# EAGLE schematic mlx90640-shield (EAGLE 9.3.0)

## Sheet 1 of 2

## Sheet 2 of 2
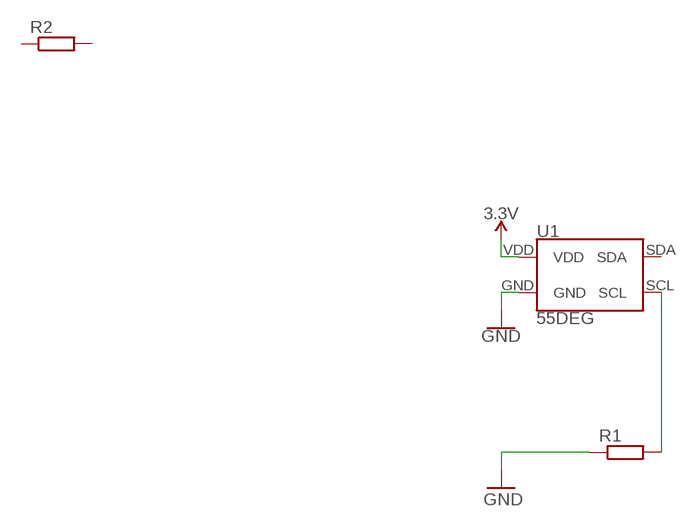
[diagram p0: schematic, sheet 2]

### Parts
R1  R-EU_0204/2V  [0204V]
R2  R-EU_0207/7  [0207/7]
U1  55DEG  MLX90540_MLX90640  [MLX90540_MLX90640]

### Nets
3.3V: U1.VDD
GND: R1.1 U1.GND
N$1: R1.2 U1.SCL
Unconnected: R2.1 R2.2 U1.SDA

## Library data of the parts
R1 R2 = rcl:R-EU_: RESISTOR, European symbol; SPICEPREFIX: R
U1 = SparkFun-IC-Special-Function:MLX90540_MLX90640: Melexis MLX90640 Infrared Array The MLX90640 is a fully calibrated 32x24 pixels thermal IR array in an industry standard 4-lead TO39 package with digital interface.; PROD_ID: IC-14042